# Altium schematic sheet CAN.SchDoc
size A4
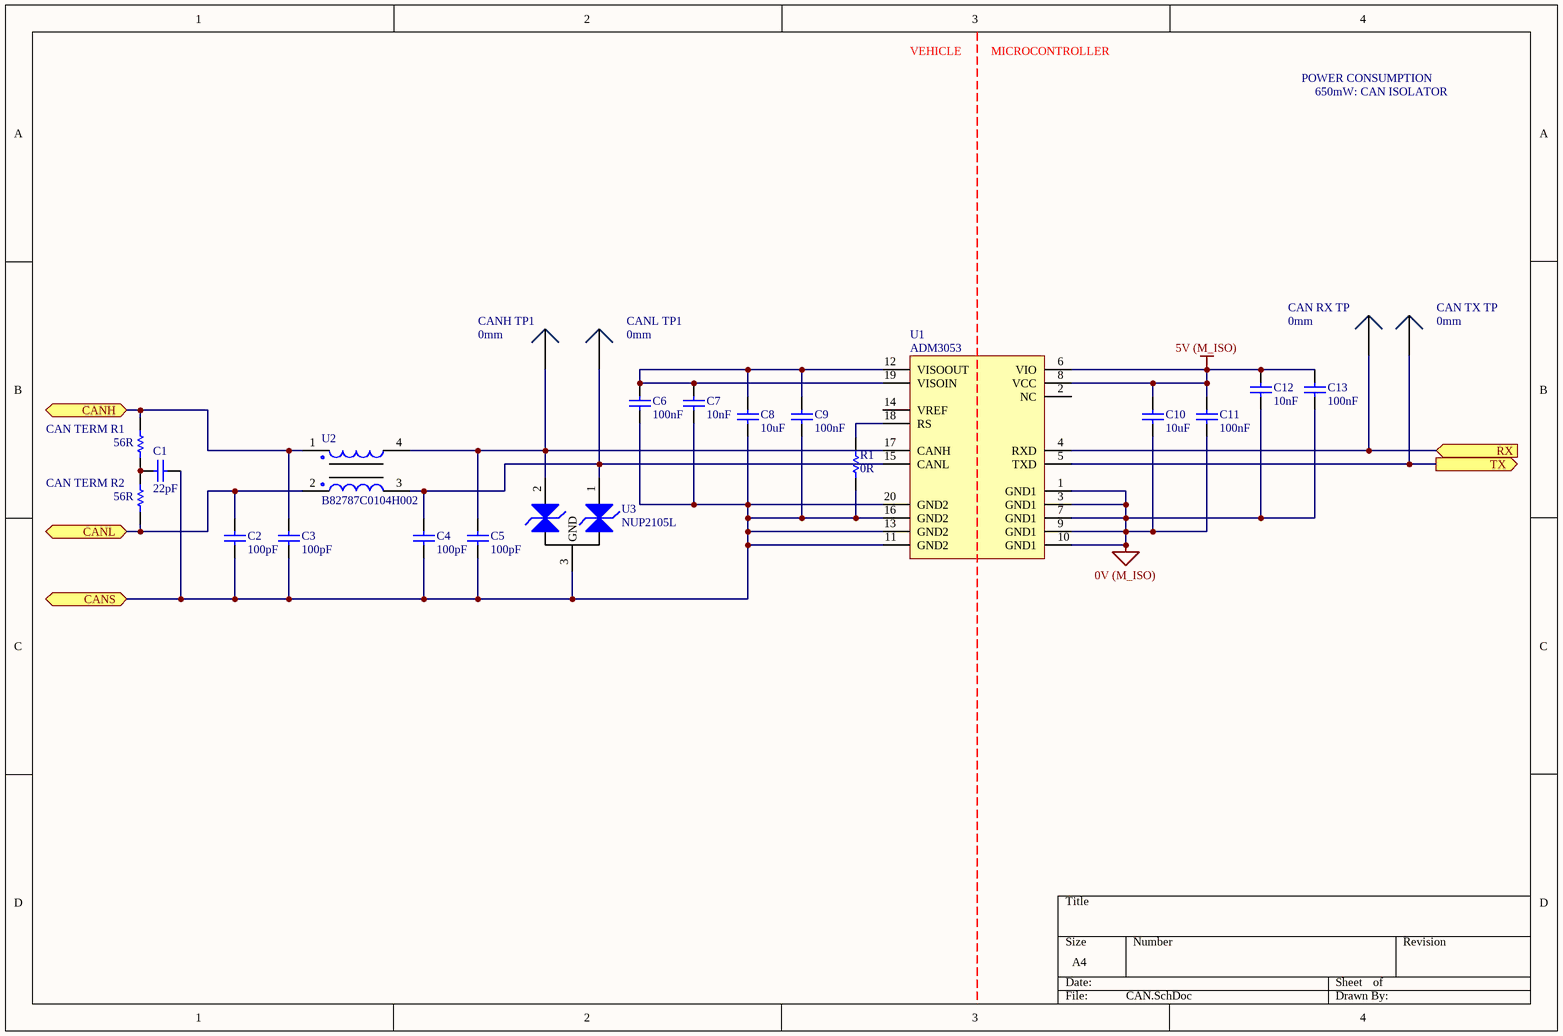
[diagram p0: CAN.SchDoc]

## Parts
C1  22pF  [0805]
C2  100pF  [0805]
C3  100pF  [0805]
C4  100pF  [0805]
C5  100pF  [0805]
C6  100nF  [0805]
C7  10nF  [1206]
C8  10uF  [0805]
C9  100nF  [0805]
C10  10uF  [0805]
C11  100nF  [0805]
C12  10nF  [1206]
C13  100nF  [0805]
CAN_RX_TP  0mm  [SMD Test Point]
CAN_TERM_R1  56R  [0805]
CAN_TERM_R2  56R  [0805]
CAN_TX_TP  0mm  [SMD Test Point]
CANH_TP1  0mm  [SMD Test Point]
CANL_TP1  0mm  [SMD Test Point]
R1  0R  [0805]
U1  ADM3053  [AD SOIC-W 20]
U2  B82787C0104H002  [TDK 4-PC Pad]
U3  NUP2105L  [ON SOT-23]

## Ports
CANH (bidir), CANL (bidir), CANS (bidir), RX (in), TX (out)

## Nets
0V (M_ISO): C10.1 C11.1 C12.1 C13.1 U1.1(GND1) U1.3(GND1) U1.7(GND1) U1.9(GND1) U1.10(GND1)
5V (M_ISO): C10.2 C11.2 C12.2 C13.2 U1.6(VIO) U1.8(VCC)
CANH: C3.2 CAN_TERM_R1.2 U2.1 ; port CANH
CANL: C2.2 CAN_TERM_R2.1 U2.2 ; port CANL
CANS: C1.1 C2.1 C3.1 C4.1 C5.1 C6.1 C7.1 C8.1 C9.1 R1.1 U1.11(GND2) U1.13(GND2) U1.16(GND2) U1.20(GND2) U3.3(GND) ; port CANS
RX: CAN_RX_TP.1 U1.4(RXD) ; port RX
TX: CAN_TX_TP.1 U1.5(TXD) ; port TX
NetC1_2: C1.2 CAN_TERM_R1.1 CAN_TERM_R2.2
NetC4_2: C4.2 CANL_TP1.1 U1.15(CANL) U2.3 U3.1(CAN_H)
NetC5_2: C5.2 CANH_TP1.1 U1.17(CANH) U2.4 U3.2(CAN_L)
NetC6_2: C6.2 C7.2 C8.2 C9.2 U1.12(VISOOUT) U1.19(VISOIN)
NetR1_2: R1.2 U1.18(RS)

Not connected (* = marked no-connect by the designer): U1 2(NC) 14(VREF)

## Notes on the sheet
- VEHICLE
- MICROCONTROLLER
- POWER CONSUMPTION
- 650mW: CAN ISOLATOR

## Library data of the parts
C1 = GCM21B5C1H220JA37L: Manufacturer: muRata; Tolerance: 5%; Material: C0G; Rated Voltage: 50V; Part Number: GCM21B5C1H220JA37L; Value: 22pF
C2-C5 = GCM21B5C1H101JA37L: Manufacturer: muRata; Tolerance: 5%; Material: C0G; Rated Voltage: 50V; Part Number: GCM21B5C1H101JA37L; Value: 100pF
C6 C9 C11 C13 = GCM21BR71E104KA37L: Manufacturer: muRata; Tolerance: 10%; Material: X7R; Rated Voltage: 25V; Part Number: GCM21BR71E104KA37L; Value: 100nF
C7 C12 = GCM3195C2A103JA16D: Manufacturer: muRata; Tolerance: 5%; Material: Ceramic; Rated Voltage: 100V; Part Number: GCM3195C2A103JA16D; Value: 10nF; Digikey Part Number: 490-4978-2-ND
C8 C10 = GRM21BR6YA106KE43L: Manufacturer: muRata; Tolerance: 10%; Material: X5R; Rated Voltage: 50V; Part Number: GRM21BR6YA106KE43L; Value: 10uF; Digikey Part Number: 490-10514-6-ND
CAN_RX_TP CAN_TX_TP CANH_TP1 CANL_TP1 = SMD Test Point: Positions: 1; Row Spacing: 0; Flange: No; Contact: NA; Part Number: SMD Test Point; Pitch: 0mm; Angle: 0
CAN_TERM_R1 CAN_TERM_R2 = RC0805FR0756RL: Manufacturer: YAGEO; Tolerance: 0.01; Rated Voltage: 0.125W; Part Number: RC0805FR0756RL; Value: 56R; Material: FR-07
R1 = RC0805FR070RL: Manufacturer: YAGEO; Tolerance: 0.01; Rated Voltage: 0.125W; Part Number: RC0805FR070RL; Value: 0R; Material: FR-07
U1 = ADM3053: Isolated CAN Transceiver; Manufacturer: Analogue Devices; Part Number: ADM3053; Digikey Part Number: ADM3053BRWZ-ND; Digikey Link: https://www.digikey.com/product-detail/en/analog-devices-inc/ADM3053BRWZ/ADM3053BRWZ-ND/2709332
U2 = B82787C0104H002: 100µH @ 100kHz 2 Line Common Mode Choke Surface Mount 5.8 kOhms @ 10MHz 150mA DCR 2Ohm; Manufacturer: EPCOS (TDK); Part Number: B82787C0104H002; Inductance: 100µH @ 100kHz; Impedence: 5.8 kOhms @ 10MHz; Material: Wirewound; Rated Current: 150mA; Digikey Part Number: 495-4598-1-ND; Digikey Link: https://www.digikey.com/product-detail/en/epcos-tdk/B82787C0104H002/495-4598-2-ND/3680998
U3 = NUP2105L: Dual Line CAN Bus Protector; Manufacturer: ON Semiconductor; Part Number: NUP2105L; Digikey Part Number: NUP2105LT1GOSCT-ND; Digikey Link: https://www.digikey.com/product-detail/en/on-semiconductor/NUP2105LT1G/NUP2105LT1GOSCT-ND/1485001